# Altium schematic sheet servo.SchDoc
size A
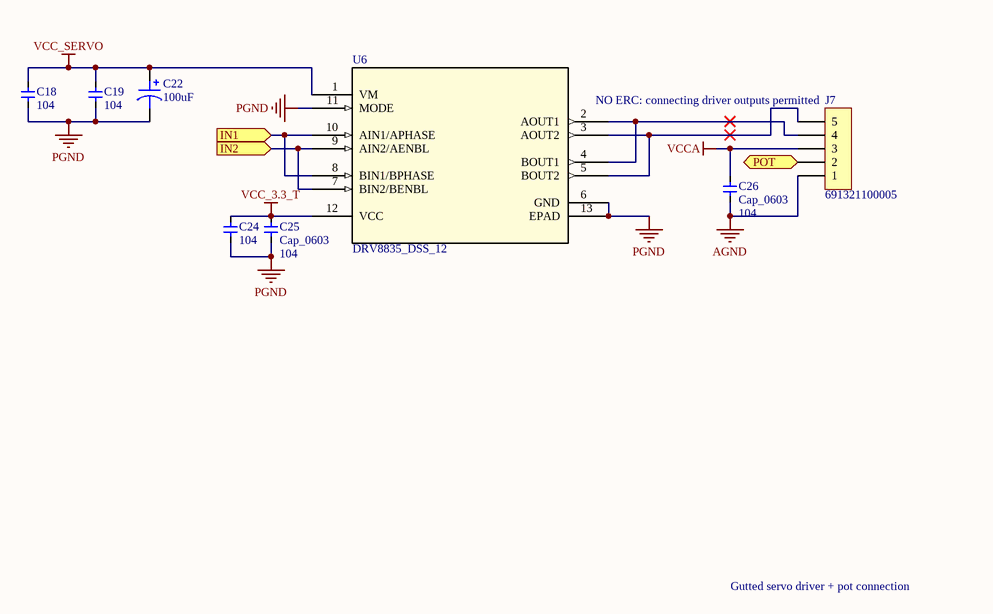
[diagram p0: servo.SchDoc]

## Parts
C18  value 104  [CAP_0603]  (hidden comment: Cap_0603)
C19  value 104  [CAP_0603]  (hidden comment: Cap_0603)
C22  100uF  [CAP ALUM 6.6MM]
C24  value 104  [CAP_0603]  (hidden comment: Cap_0603)
C25  Cap_0603  value 104  [CAP_0603]
C26  Cap_0603  value 104  [CAP_0603]
J7  691321100005  [691322110005]
U6  DRV8835_DSS_12  [DSS12_P9X2]

## Ports
IN1 (in), IN2 (in), POT (out)

## Nets
AGND: C26.2 J7.1
PGND: C18.1 C19.1 C22.2 C24.1 C25.2 U6.6(GND) U6.11(MODE) U6.13(EPAD)
VCC_3.3_T: C24.2 C25.1 U6.12(VCC)
VCC_SERVO: C18.2 C19.2 C22.1 U6.1(VM)
VCCA: C26.1 J7.3
IN1: U6.8(BIN1/BPHASE) U6.10(AIN1/APHASE) ; port IN1
IN2: U6.7(BIN2/BENBL) U6.9(AIN2/AENBL) ; port IN2
POT: J7.2 ; port POT
NetJ7_4: J7.4 U6.2(AOUT1) U6.4(BOUT1)
NetJ7_5: J7.5 U6.3(AOUT2) U6.5(BOUT2)

## Notes on the sheet
- (near J7) NO ERC: connecting driver outputs permitted
- Gutted servo driver + pot connection

## Library data of the parts
C18 C19 C24-C26 = Cap_0603: Capacitor
C22 = Polarised Capacitor: PCE4180CT-ND; Value: 100uF
J7 = 691321100005: WR-TBL Terminal block - serie 3211 - 3.50 mm; Manufacturer: Würth Elektronik eiSos GmbH; ComponentLink1 Description: Manufacturer; ComponentLink2 Description: Datasheet; NoPins: 5; Created Date: 9 December 2013; partNo: 691321100005; ComponentLink1URL: http://www.we-online.com; ComponentLink2URL: http://katalog.we-online.de/em/datasheet/6913211000xx.pdf; Created by: Karrer Zheng
U6 = DRV8835_DSS_12: Imported; Vendor: Texas Instruments; Manufacturer_Part_Number: drv8835_dss_12; Value: Value; Type: Type; RefDes: RefDes